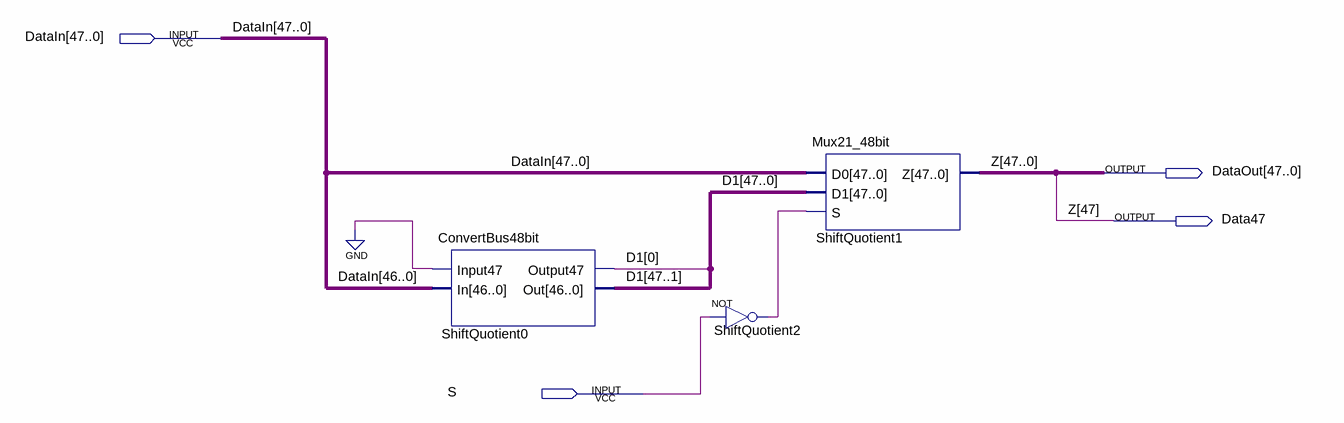
[diagram p0: schematic sheet]
// Quartus schematic ShiftLeft_Quotient.bdf as structural Verilog: 3 symbols, 4 pins
module ShiftLeft_Quotient (
  input  [47:0] DataIn,
  input  S,
  output [47:0] DataOut,
  output Data47
);

  wire ShiftQuotient2_out;
  wire [47:0] D1;

  ConvertBus48bit ShiftQuotient0 (.Input47(1'b0), .In(DataIn[46:0]), .Output47(D1[0]), .Out(D1[47:1]));
  not ShiftQuotient2 (ShiftQuotient2_out, S);
  Mux21_48bit ShiftQuotient1 (.D0(DataIn), .D1(D1), .S(ShiftQuotient2_out), .Z({Data47, DataOut[46:0]}));

  assign DataOut[47] = Data47;

  // Other names for the same wires on the sheet: Z[47:0] = {Data47, DataOut[46:0]}
endmodule
